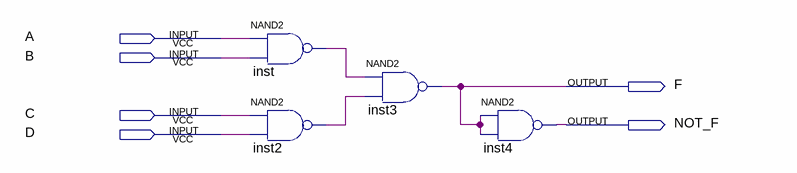
[diagram p0: schematic sheet]
// Quartus schematic Question3.bdf as structural Verilog: 4 symbols, 6 pins
module Question3 (
  input  A,
  input  B,
  input  C,
  input  D,
  output F,
  output NOT_F
);

  wire inst2_out, inst_out;

  nand inst (inst_out, A, B);
  nand inst2 (inst2_out, C, D);
  nand inst3 (F, inst_out, inst2_out);
  nand inst4 (NOT_F, F, F);
endmodule
